# Altium schematic sheet MindPX2.2.SchDoc
size A2; Date: 2015/08/19; Author: SuDragon; Revision: MindPXV2.2
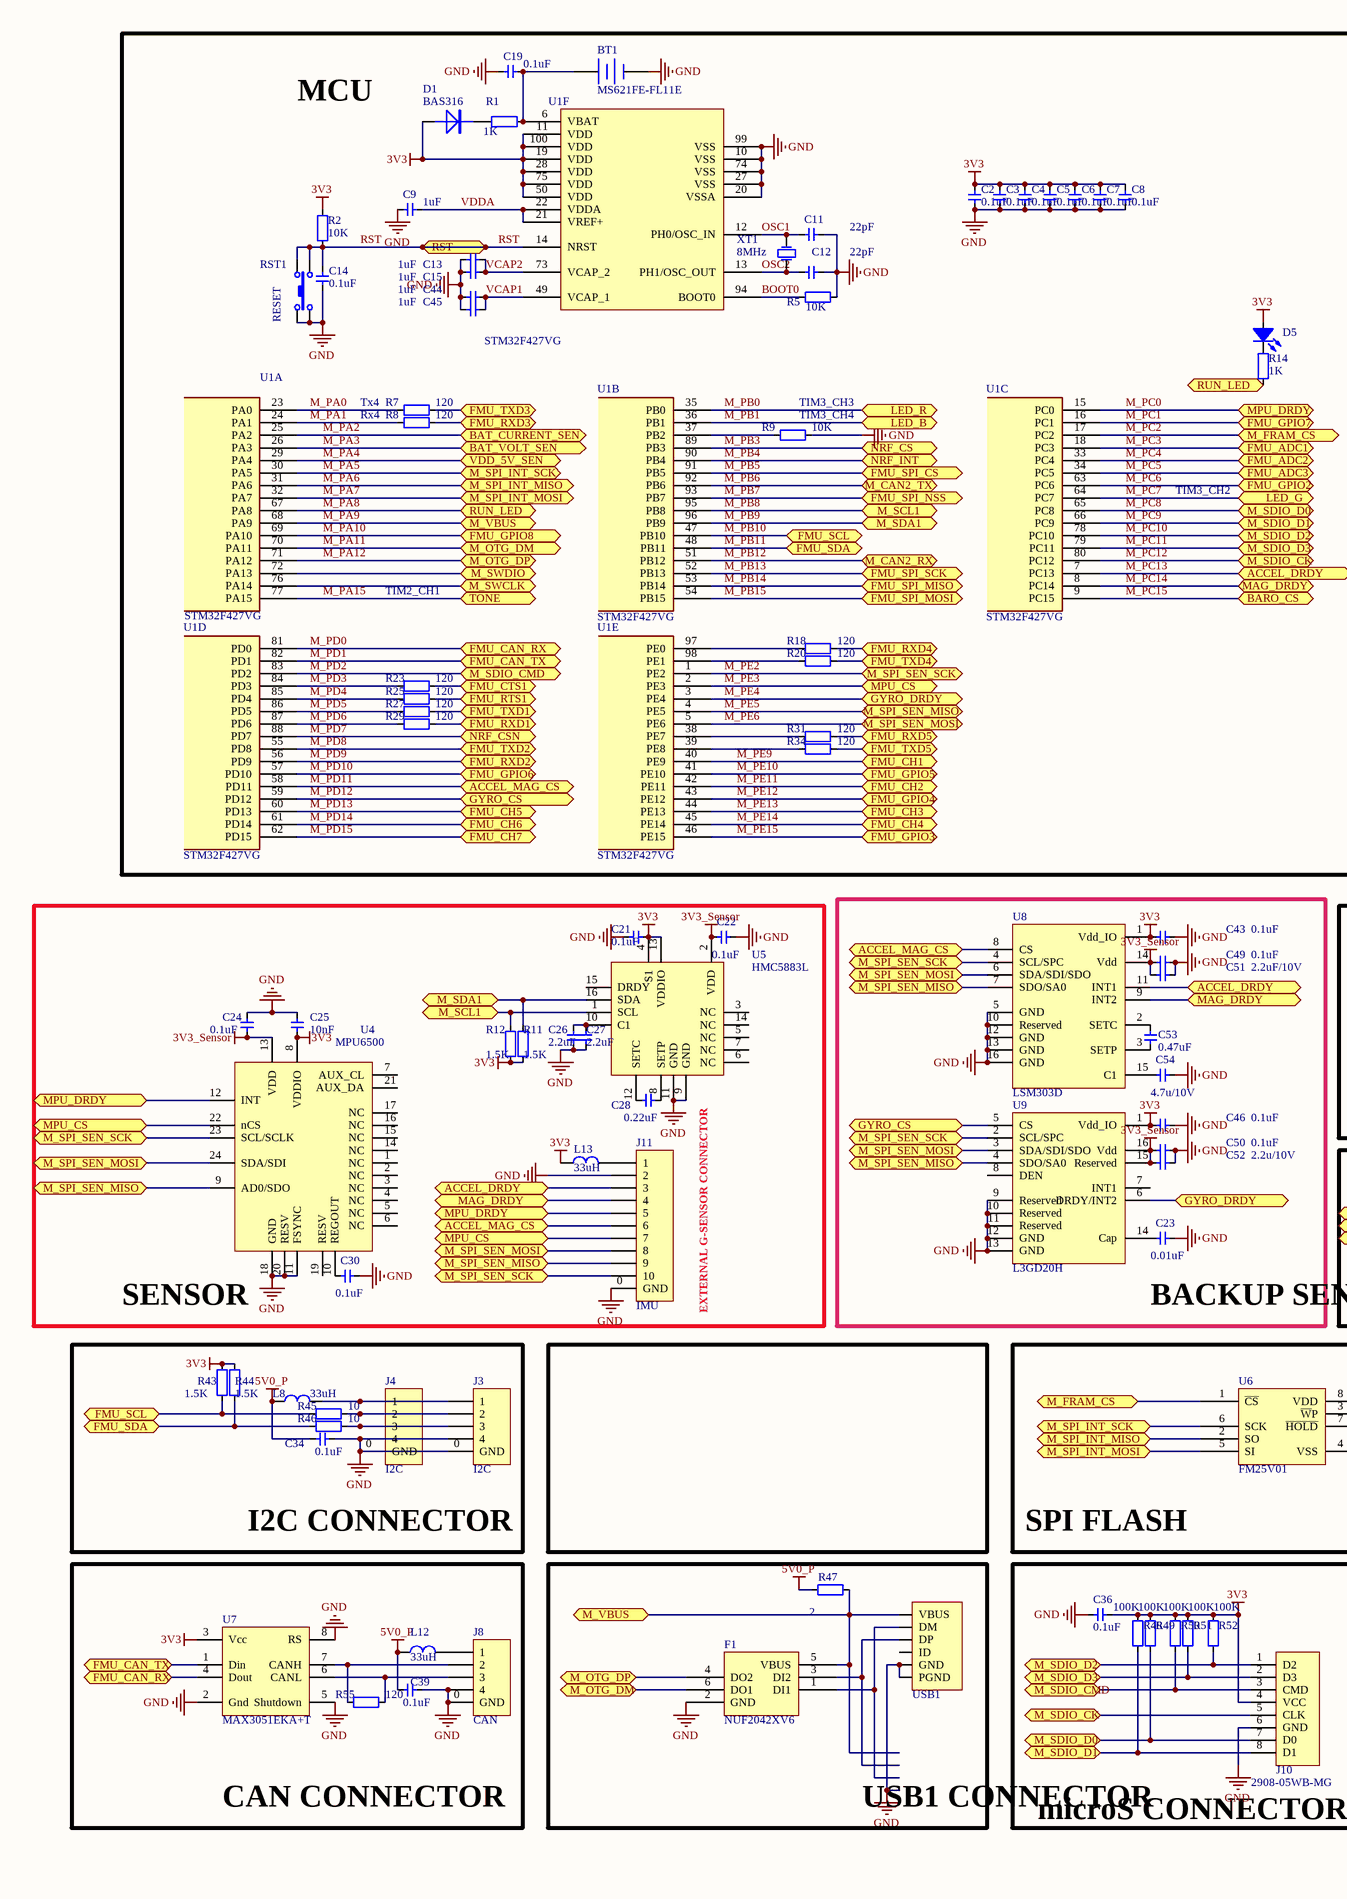
[diagram p0: MindPX2.2.SchDoc, left]
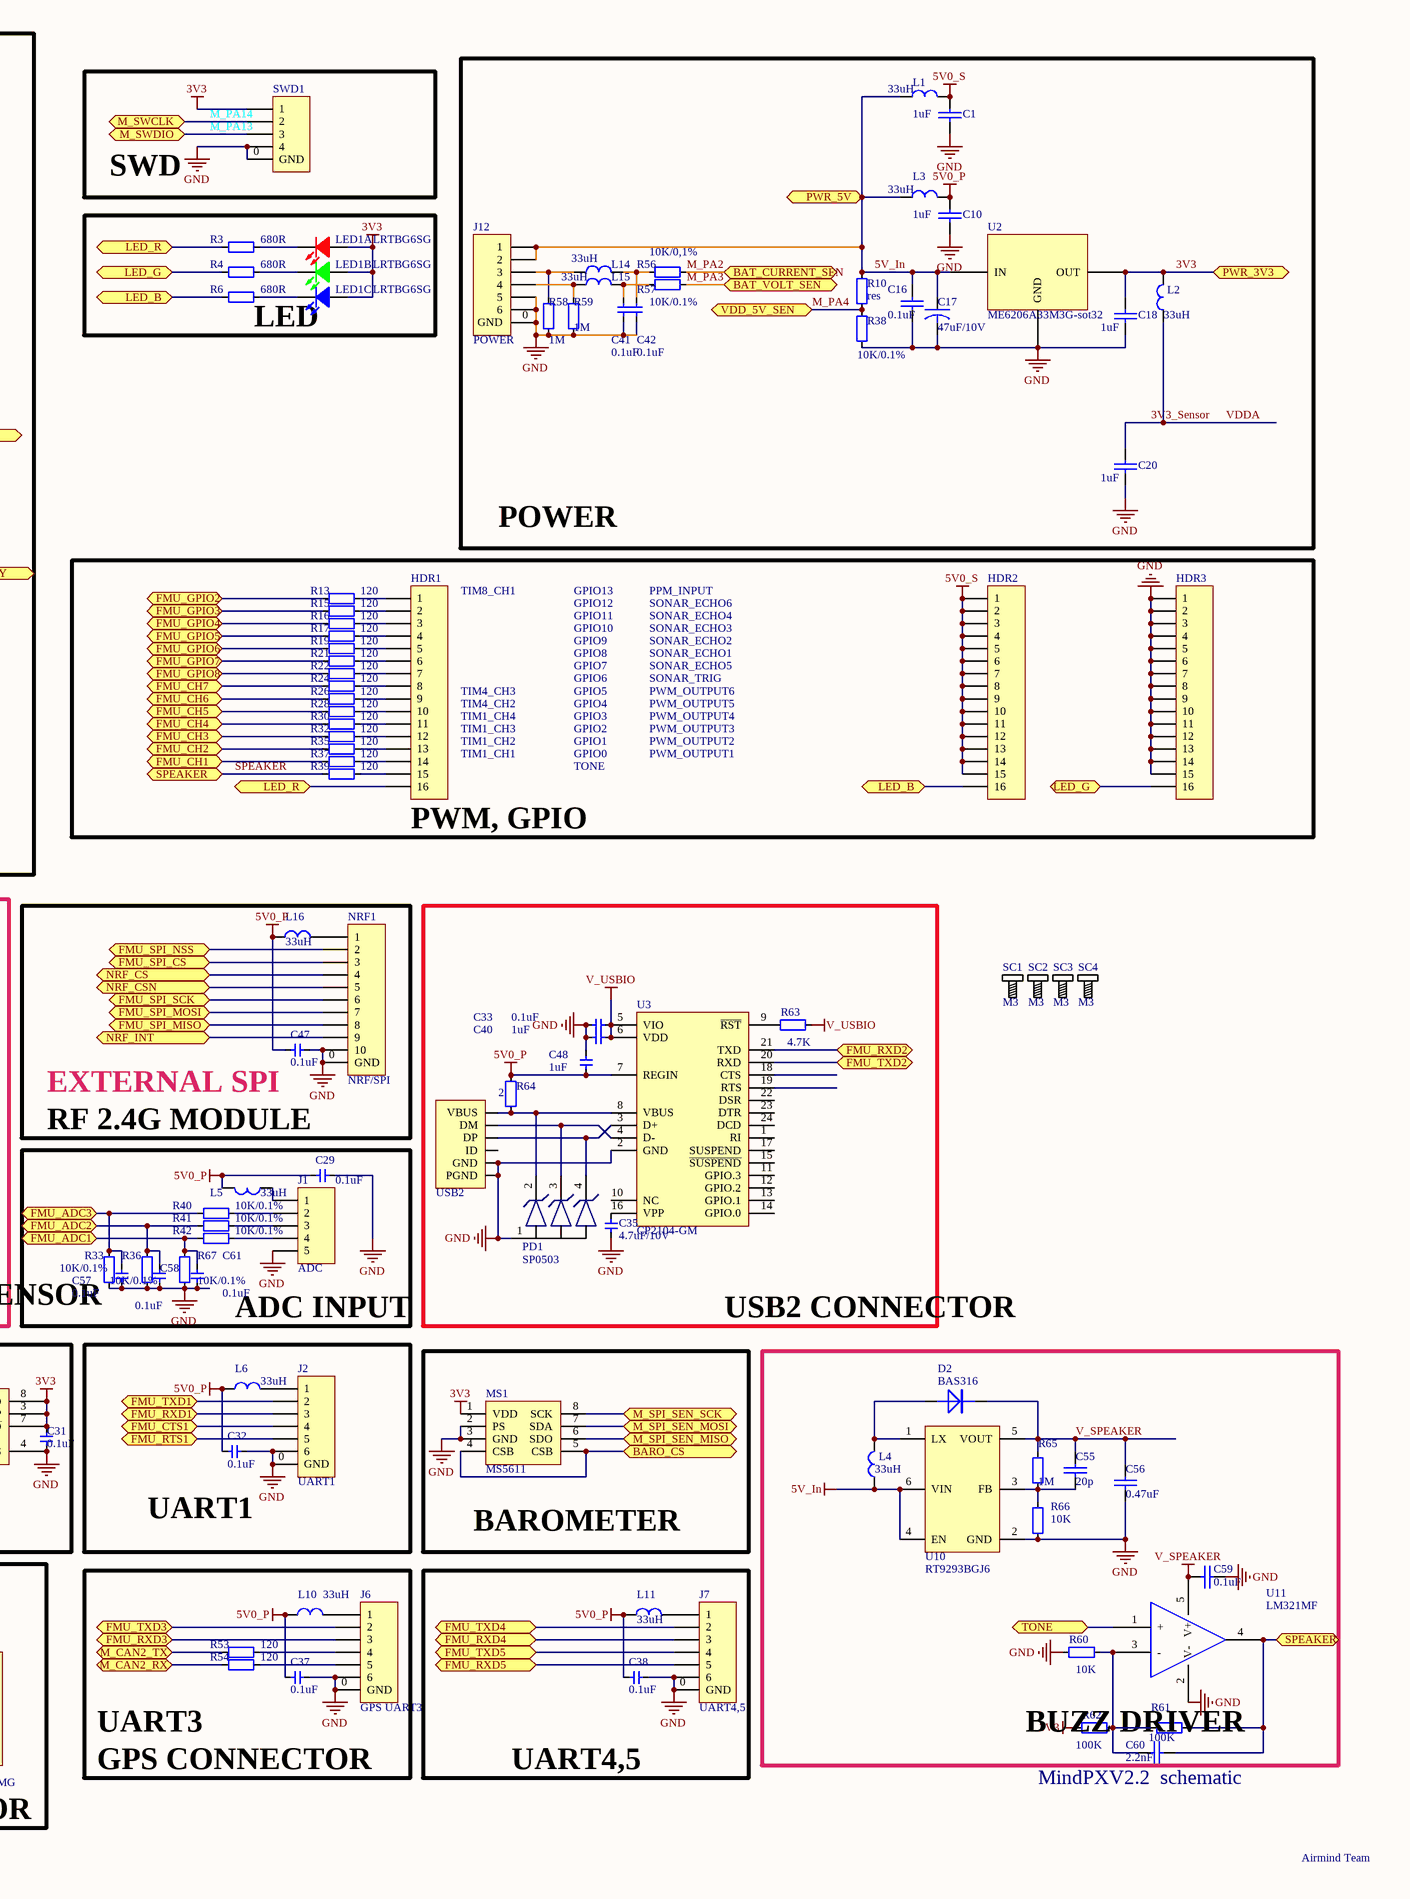
[diagram p1: MindPX2.2.SchDoc, right]

## Parts
BT1  MS621FE-FL11E  [MS621FE]
C1  value 1uF  [C0603]  (hidden comment: CAP)
C2  value 0.1uF  [C0603]  (hidden comment: cap)
C3  value 0.1uF  [C0603]  (hidden comment: cap)
C4  value 0.1uF  [C0603]  (hidden comment: cap)
C5  value 0.1uF  [C0603]  (hidden comment: cap)
C6  value 0.1uF  [C0603]  (hidden comment: cap)
C7  value 0.1uF  [C0603]  (hidden comment: cap)
C8  value 0.1uF  [C0603]  (hidden comment: cap)
C9  value 1uF  [C0603]  (hidden comment: cap)
C10  value 1uF  [C0603]  (hidden comment: CAP)
C11  value 22pF  [C0603]  (hidden comment: cap)
C12  value 22pF  [C0603]  (hidden comment: cap)
C13  value 1uF  [C0603]  (hidden comment: cap)
C14  value 0.1uF  [C0603]  (hidden comment: cap)
C15  value 1uF  [C0603]  (hidden comment: cap)
C16  value 0.1uF  [C0603]  (hidden comment: CAP)
C17  value 47uF/10V  [钽电容]  (hidden comment: cap)
C18  value 1uF  [C0603]  (hidden comment: CAP)
C19  value 0.1uF  [C0603]  (hidden comment: cap)
C20  1uF  [C0603]
C21  value 0.1uF  [C0603]  (hidden comment: cap)
C22  value 0.1uF  [C0603]  (hidden comment: cap)
C23  value 0.01uF  [C0603]  (hidden comment: cap)
C24  0.1uF  [C0603]
C25  10nF  [C0603]
C26  value 2.2uF  [C0603]  (hidden comment: cap)
C27  value 2.2uF  [C0603]  (hidden comment: cap)
C28  value 0.22uF  [C0603]  (hidden comment: cap)
C29  value 0.1uF  [C0603]  (hidden comment: cap)
C30  value 0.1uF  [C0603]  (hidden comment: cap)
C31  value 0.1uF  [C0603]  (hidden comment: cap)
C32  value 0.1uF  [C0603]  (hidden comment: cap)
C33  value 0.1uF  [C0603]  (hidden comment: cap)
C34  value 0.1uF  [C0603]  (hidden comment: cap)
C35  value 4.7uF/10V  [C0603]  (hidden comment: cap)
C36  value 0.1uF  [C0603]  (hidden comment: cap)
C37  value 0.1uF  [C0603]  (hidden comment: cap)
C38  value 0.1uF  [C0603]  (hidden comment: cap)
C39  value 0.1uF  [C0603]  (hidden comment: cap)
C40  value 1uF  [C0603]  (hidden comment: cap)
C41  value 0.1uF  [C0603]  (hidden comment: cap)
C42  value 0.1uF  [C0603]  (hidden comment: cap)
C43  value 0.1uF  [C0603]  (hidden comment: cap)
C44  value 1uF  [C0603]  (hidden comment: cap)
C45  value 1uF  [C0603]  (hidden comment: cap)
C46  value 0.1uF  [C0603]  (hidden comment: cap)
C47  0.1uF  [C0603]
C48  value 1uF  [C0603]  (hidden comment: cap)
C49  value 0.1uF  [C0603]  (hidden comment: cap)
C50  value 0.1uF  [C0603]  (hidden comment: cap)
C51  value 2.2uF/10V  [C0603]  (hidden comment: cap)
C52  value 2.2u/10V  [C0603]  (hidden comment: cap)
C53  value 0.47uF  [C0603]  (hidden comment: cap)
C54  value 4.7u/10V  [C0603]  (hidden comment: cap)
C55  value 20p  [C0603]  (hidden comment: CAP)
C56  value 0.47uF  [C0805]  (hidden comment: CAP)
C57  value 0.1uF  [C0603]  (hidden comment: cap)
C58  value 0.1uF  [C0603]  (hidden comment: cap)
C59  value 0.1uF  [C0603]  (hidden comment: CAP)
C60  value 2.2nF  [C0603]  (hidden comment: CAP)
C61  value 0.1uF  [C0603]  (hidden comment: cap)
D1  BAS316  [SOD323_AK]
D2  BAS316  [SOD323_AK]
D5  LED_0603  [0603]  (value not drawn)
F1  NUF2042XV6  [SOT-563-6]
HDR1  MHDR1X16  [HDR1X16]  (value not drawn)
HDR2  MHDR1X16  [HDR1X16]  (value not drawn)
HDR3  MHDR1X16  [HDR1X16]  (value not drawn)
J1  ADC  [HDR1X5]
J2  UART1  [DF13A-6P-1.25H]
J3  I2C  [DF13A-4P-1.25H]
J4  I2C  [DF13A-4P-1.25H]
J6  GPS UART3  [DF13A-6P-1.25H]
J7  UART4,5  [DF13A-6P-1.25H]
J8  CAN  [DF13A-4P-1.25H]
J10  2908-05WB-MG  [SD_Card_TF]
J11  IMU  [FPC10/0.5]
J12  POWER  [DF13A-6P-1.25H]
L1  value 33uH  [L0603]  (hidden comment: ind)
L2  33uH  [L0603]
L3  value 33uH  [L0603]  (hidden comment: ind)
L4  value 33uH  [L0805]  (hidden comment: Ind)
L5  value 33uH  [L0603]  (hidden comment: inductor)
L6  value 33uH  [L0603]  (hidden comment: ind)
L8  value 33uH  [L0603]  (hidden comment: ind)
L10  33uH  [L0603]
L11  value 33uH  [L0603]  (hidden comment: ind)
L12  value 33uH  [L0603]  (hidden comment: ind)
L13  value 33uH  [L0603]  (hidden comment: induator)
L14  value 33uH  [L0603]  (hidden comment: ind)
L15  value 33uH  [L0603]  (hidden comment: ind)
L16  value 33uH  [L0603]  (hidden comment: inductor)
LED1  LRTBG6SG  [LRTBG6SG]  (parts A,B,C of 3)
MS1  MS5611  [MS5611]
NRF1  NRF/SPI  [DF13A-10P-1.25H]
PD1  SP0503
R1  value 1K  [R0603]  (hidden comment: res)
R2  value 10K  [R0603]  (hidden comment: cap)
R3  value 680R  [R0603]  (hidden comment: res)
R4  value 680R  [R0603]  (hidden comment: res)
R5  value 10K  [R0603]  (hidden comment: res)
R6  value 680R  [R0603]  (hidden comment: res)
R7  value 120  [R0603]  (hidden comment: res)
R8  value 120  [R0603]  (hidden comment: res)
R9  value 10K  [R0603]  (hidden comment: res)
R10  res  [R0603]
R11  value 1.5K  [R0603]  (hidden comment: res)
R12  value 1.5K  [R0603]  (hidden comment: res)
R13  value 120  [R0603]  (hidden comment: res)
R14  value 1K  [R0603]  (hidden comment: res)
R15  value 120  [R0603]  (hidden comment: res)
R16  value 120  [R0603]  (hidden comment: res)
R17  value 120  [R0603]  (hidden comment: res)
R18  value 120  [R0603]  (hidden comment: res)
R19  value 120  [R0603]  (hidden comment: res)
R20  value 120  [R0603]  (hidden comment: res)
R21  value 120  [R0603]  (hidden comment: res)
R22  value 120  [R0603]  (hidden comment: res)
R23  value 120  [R0603]  (hidden comment: res)
R24  value 120  [R0603]  (hidden comment: res)
R25  value 120  [R0603]  (hidden comment: res)
R26  value 120  [R0603]  (hidden comment: res)
R27  value 120  [R0603]  (hidden comment: res)
R28  value 120  [R0603]  (hidden comment: res)
R29  value 120  [R0603]  (hidden comment: res)
R30  value 120  [R0603]  (hidden comment: res)
R31  value 120  [R0603]  (hidden comment: res)
R32  value 120  [R0603]  (hidden comment: res)
R33  value 10K/0.1%  [R0603]  (hidden comment: res)
R34  value 120  [R0603]  (hidden comment: res)
R35  value 120  [R0603]  (hidden comment: res)
R36  value 10K/0.1%  [R0603]  (hidden comment: res)
R37  value 120  [R0603]  (hidden comment: res)
R38  value 10K/0.1%  [R0603]  (hidden comment: res)
R39  value 120  [R0603]  (hidden comment: res)
R40  value 10K/0.1%  [R0603]  (hidden comment: res)
R41  value 10K/0.1%  [R0603]  (hidden comment: res)
R42  value 10K/0.1%  [R0603]  (hidden comment: res)
R43  value 1.5K  [R0603]  (hidden comment: res)
R44  value 1.5K  [R0603]  (hidden comment: res)
R45  value 10  [R0603]  (hidden comment: res)
R46  value 10  [R0603]  (hidden comment: res)
R47  value 2  [R0603]  (hidden comment: res)
R48  value 100K  [R0603]  (hidden comment: res)
R49  value 100K  [R0603]  (hidden comment: res)
R50  value 100K  [R0603]  (hidden comment: res)
R51  value 100K  [R0603]  (hidden comment: res)
R52  value 100K  [R0603]  (hidden comment: res)
R53  value 120  [R0603]  (hidden comment: res)
R54  value 120  [R0603]  (hidden comment: res)
R55  value 120  [R0603]  (hidden comment: res)
R56  value 10K/0,1%  [R0603]  (hidden comment: res)
R57  value 10K/0.1%  [R0603]  (hidden comment: res)
R58  value 1M  [R0603]  (hidden comment: res)
R59  value 1M  [R0603]  (hidden comment: res)
R60  value 10K  [R0603]  (hidden comment: res)
R61  value 100K  [R0603]  (hidden comment: res)
R62  value 100K  [R0603]  (hidden comment: res)
R63  value 4.7K  [R0603]  (hidden comment: res)
R64  value 2  [R0603]  (hidden comment: res)
R65  value 1M  [R0603]  (hidden comment: res)
R66  value 10K  [R0603]  (hidden comment: res)
R67  value 10K/0.1%  [R0603]  (hidden comment: res)
RST1  RESET  [BT_TACT_3.5*3.55_90]
SC1  M3  [SCRREW_M3]
SC2  M3  [SCRREW_M3]
SC3  M3  [SCRREW_M3]
SC4  M3  [SCRREW_M3]
SWD1  DEBUG  [DF13A-4P-1.25H]  (value not drawn)
U1  STM32F427VG  (parts A,B,C,D,E,F of 6)
U2  ME6206A33M3G-sot32  [me6206a33mg-sot23]
U3  CP2104-GM  [QFN24]
U4  MPU6500  [MPU6500]
U5  HMC5883L  [LPcc16]
U6  FM25V01  [so8]
U7  MAX3051EKA+T  [SOT23-8]
U8  LSM303D  [LSM303D]
U9  L3GD20H  [L3GD20H]
U10  RT9293BGJ6  [TSOT23-6]
U11  LM321MF  [SOT23-5]
USB1  USB_QG  [MicroUSB_T2]  (value not drawn)
USB2  USB_Micro  [MicroUSB_T2]  (value not drawn)
XT1  value 8MHz  [XTAL_5032]  (hidden comment: XTAL_5032_2P)

## Blocks framed on the sheet
MCU: BT1 C2-C9 C11-C15 C19 C44 C45 D1 D5 R1 R2 R5 R7-R9 R14 R18 R20 R23 R25 R27 R29 R31 R34 RST1 U1 XT1
POWER: C1 C10 C16-C18 C20 C41 C42 J12 L1-L3 L14 L15 R10 R38 R56-R59 U2
SWD: SWD1
LED: LED1 R3 R4 R6
PWM, GPIO: HDR1-HDR3 R13 R15-R17 R19 R21 R22 R24 R26 R28 R30 R32 R35 R37 R39
SENSOR: C21 C22 C24-C28 C30 J11 L13 R11 R12 U4 U5
BACKUP SENSOR: C23 C43 C46 C49-C54 U8 U9
USB2 CONNECTOR: C33 C35 C40 C48 PD1 R63 R64 U3 USB2
I2C CONNECTOR: C34 J3 J4 L8 R43-R46
SPI FLASH: C31 U6
UART1: C32 J2 L6
BAROMETER: MS1
BUZZ DRIVER: C55 C56 C59 C60 D2 L4 R60-R62 R65 R66 U10 U11
CAN CONNECTOR: C39 J8 L12 R55 U7
USB1 CONNECTOR: F1 R47 USB1
UART4,5: C38 J7 L11

## Ports
ACCEL_DRDY, ACCEL_MAG_CS, BARO_CS, BAT_CURRENT_SEN, BAT_VOLT_SEN, FMU_ADC1, FMU_ADC2, FMU_ADC3, FMU_CAN_RX, FMU_CAN_TX, FMU_CH1, FMU_CH2, FMU_CH3, FMU_CH4, FMU_CH5, FMU_CH6, FMU_CH7, FMU_CTS1, FMU_GPIO2, FMU_GPIO3, FMU_GPIO4, FMU_GPIO5, FMU_GPIO6, FMU_GPIO7, FMU_GPIO8, FMU_RTS1, FMU_RXD1, FMU_RXD2, FMU_RXD3, FMU_RXD4, FMU_RXD5, FMU_SCL, FMU_SDA, FMU_SPI_CS, FMU_SPI_MISO, FMU_SPI_MOSI, FMU_SPI_NSS, FMU_SPI_SCK, FMU_TXD1, FMU_TXD2, FMU_TXD3, FMU_TXD4, FMU_TXD5, GYRO_CS, GYRO_DRDY, LED_B, LED_G, LED_R, M_CAN2_RX, M_CAN2_TX, M_FRAM_CS, M_OTG_DM, M_OTG_DP, M_SCL1, M_SDA1, M_SDIO_CK, M_SDIO_CMD, M_SDIO_D0, M_SDIO_D1, M_SDIO_D2, M_SDIO_D3, M_SPI_INT_MISO, M_SPI_INT_MOSI, M_SPI_INT_SCK, M_SPI_SEN_MISO, M_SPI_SEN_MOSI, M_SPI_SEN_SCK, M_SWCLK, M_SWDIO, M_VBUS, MAG_DRDY, MPU_CS, MPU_DRDY, NRF_CS, NRF_CSN, NRF_INT, PWR_3V3, PWR_5V, RST, RUN_LED, SPEAKER, TONE, VDD_5V_SEN

## Nets
3V3: C2.1 C3.1 C4.1 C5.1 C6.1 C7.1 C8.1 C18.1 C21.2 C25.1 C31.1 C36.1 C43.2 C46.2 D1.A D5.2(A) J10.4(VCC) L2.2 L13.1 LED1.A1 LED1.A2 LED1.A3 MS1.1(VDD) R2.2 R11.2 R12.1 R43.1 R44.1 R48.1 R49.1 R50.1 R51.1 R52.1 R62.2 SWD1.1 U1.11(VDD) U1.19(VDD) U1.28(VDD) U1.50(VDD) U1.75(VDD) U1.100(VDD) U2.2(OUT) U4.8(VDDIO) U5.4(S1) U5.13(VDDIO) U6.3(~{W}P) U6.7(~{HOLD}) U6.8(VDD) U7.3(Vcc) U8.1(Vdd_IO) U9.1(Vdd_IO) ; port PWR_3V3
3V3_Sensor: C9.1 C20.1 C22.1 C24.2 C49.2 C50.2 C51.2 C52.2 L2.1 U1.21(VREF+) U1.22(VDDA) U4.13(VDD) U5.2(VDD) U8.14(Vdd) U9.15(Reserved) U9.16(Vdd)  [also labelled VDDA]
5V0_P: C10.1 C29.1 C32.1 C34.1 C37.1 C38.1 C39.1 C47.1 C48.2 L3.2 L5.2 L6.1 L8.1 L10.1 L11.1 L12.1 L16.1 R47.1 R64.1 U3.7(REGIN)
5V0_S: C1.1 HDR2.1 HDR2.2 HDR2.3 HDR2.4 HDR2.5 HDR2.6 HDR2.7 HDR2.8 HDR2.9 HDR2.10 HDR2.11 HDR2.12 HDR2.13 HDR2.14 HDR2.15 L1.2
5V_In: C16.1 C17.1 J12.1 J12.2 L1.1 L3.1 L4.1 R10.1 U2.3(IN) U10.4(EN) U10.6(VIN) ; port PWR_5V
GND: BT1.2(-) C1.2 C2.2 C3.2 C4.2 C5.2 C6.2 C7.2 C8.2 C9.2 C10.2 C11.1 C12.1 C13.1 C14.2 C15.2 C16.2 C17.2 C18.2 C19.2 C20.2 C21.1 C22.2 C23.1 C24.1 C25.2 C26.1 C27.1 C29.2 C30.1 C31.2 C32.2 C33.1 C34.2 C35.1 C36.2 C37.2 C38.2 C39.2 C40.1 C41.2 C42.2 C43.1 C44.2 C45.2 C46.1 C47.2 C48.1 C49.1 C50.1 C51.1 C52.1 C54.1 C56.2 C57.1 C58.1 C59.2 C61.1 F1.2(GND) HDR3.1 HDR3.2 HDR3.3 HDR3.4 HDR3.5 HDR3.6 HDR3.7 HDR3.8 HDR3.9 HDR3.10 HDR3.11 HDR3.12 HDR3.13 HDR3.14 HDR3.15 J1.5 J2.0(GND) J2.6 J3.0(GND) J3.4 J4.0(GND) J4.4 J6.0(GND) J6.6 J7.0(GND) J7.6 J8.0(GND) J8.4 J10.6(GND) J11.0(GND) J11.2 J12.0(GND) J12.5 J12.6 MS1.2(PS) MS1.3(GND) NRF1.0(GND) NRF1.10 PD1.1 R5.1 R9.1 R33.2 R36.2 R38.2 R58.2 R59.2 R60.1 R66.2 R67.2 RST1.1 RST1.3 SC1.0(GND) SC2.0(GND) SC3.0(GND) SC4.0(GND) SWD1.0(GND) SWD1.4 U1.10(VSS) U1.20(VSSA) U1.27(VSS) U1.74(VSS) U1.99(VSS) U2.1(GND) U3.2(GND) U4.11(FSYNC) U4.18(GND) U4.20(RESV) U5.9(GND) U5.11(GND) U6.4(VSS) U7.2(Gnd) U7.5(Shutdown) U7.8(RS) U8.5(GND) U8.10(Reserved) U8.12(GND) U8.13(GND) U8.16(GND) U9.9(Reserved) U9.10(Reserved) U9.11(Reserved) U9.12(GND) U9.13(GND) U10.2(GND) U11.2(V-) USB1.0(PGND) USB1.5(GND) USB2.0(PGND) USB2.5(GND)
V_SPEAKER: C55.1 C56.1 C59.1 D2.K R65.1 U10.5(VOUT) U11.5(V+)
V_USBIO: C33.2 C40.2 R63.2 U3.5(VIO) U3.6(VDD)
BOOT0: R5.2 U1.94(BOOT0)
FMU_CTS1: J2.4 R23.1 ; port FMU_CTS1
FMU_RTS1: J2.5 R25.1 ; port FMU_RTS1
FMU_RXD1: J2.3 R29.1 ; port FMU_RXD1
FMU_RXD3: J6.3 R8.1 ; port FMU_RXD3
FMU_RXD4: J7.3 R18.1 ; port FMU_RXD4
FMU_RXD5: J7.5 R31.1 ; port FMU_RXD5
FMU_TXD1: J2.2 R27.1 ; port FMU_TXD1
FMU_TXD3: J6.2 R7.1 ; port FMU_TXD3
FMU_TXD4: J7.2 R20.1 ; port FMU_TXD4
FMU_TXD5: J7.4 R34.1 ; port FMU_TXD5
M_PA0: R7.2 U1.23(PA0)
M_PA1: R8.2 U1.24(PA1)
M_PA2: R56.1 U1.25(PA2) ; port BAT_CURRENT_SEN
M_PA3: R57.1 U1.26(PA3) ; port BAT_VOLT_SEN
M_PA4: R10.2 R38.1 U1.29(PA4) ; port VDD_5V_SEN
M_PA5: U1.30(PA5) U6.6(SCK) ; port M_SPI_INT_SCK
M_PA6: U1.31(PA6) U6.2(SO) ; port M_SPI_INT_MISO
M_PA7: U1.32(PA7) U6.5(SI) ; port M_SPI_INT_MOSI
M_PA8: R14.1 U1.67(PA8) ; port RUN_LED
M_PA9: F1.5(VBUS) R47.2 U1.68(PA9) USB1.1(VBUS) ; port M_VBUS
M_PA10: R22.2 U1.69(PA10) ; port FMU_GPIO8
M_PA11: F1.6(DO1) U1.70(PA11) ; port M_OTG_DM
M_PA12: F1.4(DO2) U1.71(PA12) ; port M_OTG_DP
M_PA13: SWD1.3 U1.72(PA13) ; port M_SWDIO
M_PA14: SWD1.2 U1.76(PA14) ; port M_SWCLK
M_PA15: U1.77(PA15) U11.1(+) ; port TONE
M_PB0: HDR1.16 R3.2 U1.35(PB0) ; port LED_R
M_PB1: HDR2.16 R6.2 U1.36(PB1) ; port LED_B
M_PB3: NRF1.4 U1.89(PB3) ; port NRF_CS
M_PB4: NRF1.9 U1.90(PB4) ; port NRF_INT
M_PB5: NRF1.3 U1.91(PB5) ; port FMU_SPI_CS
M_PB6: R53.2 U1.92(PB6) ; port M_CAN2_TX
M_PB7: NRF1.2 U1.93(PB7) ; port FMU_SPI_NSS
M_PB8: R12.2 U1.95(PB8) U5.1(SCL) ; port M_SCL1
M_PB9: R11.1 U1.96(PB9) U5.16(SDA) ; port M_SDA1
M_PB10: R43.2 R45.2 U1.47(PB10) ; port FMU_SCL
M_PB11: R44.2 R46.2 U1.48(PB11) ; port FMU_SDA
M_PB12: R54.2 U1.51(PB12) ; port M_CAN2_RX
M_PB13: NRF1.6 U1.52(PB13) ; port FMU_SPI_SCK
M_PB14: NRF1.8 U1.53(PB14) ; port FMU_SPI_MISO
M_PB15: NRF1.7 U1.54(PB15) ; port FMU_SPI_MOSI
M_PC0: J11.5 U1.15(PC0) U4.12(INT) ; port MPU_DRDY
M_PC1: R21.2 U1.16(PC1) ; port FMU_GPIO7
M_PC2: U1.17(PC2) U6.1(~{CS}) ; port M_FRAM_CS
M_PC3: C61.2 R42.2 R67.1 U1.18(PC3) ; port FMU_ADC1
M_PC4: C58.2 R36.1 R41.2 U1.33(PC4) ; port FMU_ADC2
M_PC5: C57.2 R33.1 R40.2 U1.34(PC5) ; port FMU_ADC3
M_PC6: R13.2 U1.63(PC6) ; port FMU_GPIO2
M_PC7: HDR3.16 R4.2 U1.64(PC7) ; port LED_G
M_PC8: J10.7(D0) R49.2 U1.65(PC8) ; port M_SDIO_D0
M_PC9: J10.8(D1) R48.2 U1.66(PC9) ; port M_SDIO_D1
M_PC10: J10.1(D2) R52.2 U1.78(PC10) ; port M_SDIO_D2
M_PC11: J10.2(D3) R51.2 U1.79(PC11) ; port M_SDIO_D3
M_PC12: J10.5(CLK) U1.80(PC12) ; port M_SDIO_CK
M_PC13: J11.3 U1.7(PC13) U8.11(INT1) ; port ACCEL_DRDY
M_PC14: J11.4 U1.8(PC14) U8.9(INT2) ; port MAG_DRDY
M_PC15: MS1.4(CSB) MS1.5(CSB) U1.9(PC15) ; port BARO_CS
M_PD0: U1.81(PD0) U7.4(Dout) ; port FMU_CAN_RX
M_PD1: U1.82(PD1) U7.1(Din) ; port FMU_CAN_TX
M_PD2: J10.3(CMD) R50.2 U1.83(PD2) ; port M_SDIO_CMD
M_PD3: R23.2 U1.84(PD3)
M_PD4: R25.2 U1.85(PD4)
M_PD5: R27.2 U1.86(PD5)
M_PD6: R29.2 U1.87(PD6)
M_PD7: NRF1.5 U1.88(PD7) ; port NRF_CSN
M_PD8: U1.55(PD8) U3.20(RXD) ; port FMU_TXD2
M_PD9: U1.56(PD9) U3.21(TXD) ; port FMU_RXD2
M_PD10: R19.2 U1.57(PD10) ; port FMU_GPIO6
M_PD11: J11.6 U1.58(PD11) U8.8(CS) ; port ACCEL_MAG_CS
M_PD12: U1.59(PD12) U9.5(CS) ; port GYRO_CS
M_PD13: R28.2 U1.60(PD13) ; port FMU_CH5
M_PD14: R26.2 U1.61(PD14) ; port FMU_CH6
M_PD15: R24.2 U1.62(PD15) ; port FMU_CH7
M_PE2: J11.10 MS1.8(SCK) U1.1(PE2) U4.23(SCL/SCLK) U8.4(SCL/SPC) U9.2(SCL/SPC) ; port M_SPI_SEN_SCK
M_PE3: J11.7 U1.2(PE3) U4.22(nCS) ; port MPU_CS
M_PE4: U1.3(PE4) U9.6(DRDY/INT2) ; port GYRO_DRDY
M_PE5: J11.9 MS1.6(SDO) U1.4(PE5) U4.9(AD0/SDO) U8.7(SDO/SA0) U9.4(SDO/SA0) ; port M_SPI_SEN_MISO
M_PE6: J11.8 MS1.7(SDA) U1.5(PE6) U4.24(SDA/SDI) U8.6(SDA/SDI/SDO) U9.3(SDA/SDI/SDO) ; port M_SPI_SEN_MOSI
M_PE9: R37.2 U1.40(PE9) ; port FMU_CH1
M_PE10: R17.2 U1.41(PE10) ; port FMU_GPIO5
M_PE11: R35.2 U1.42(PE11) ; port FMU_CH2
M_PE12: R16.2 U1.43(PE12) ; port FMU_GPIO4
M_PE13: R32.2 U1.44(PE13) ; port FMU_CH3
M_PE14: R30.2 U1.45(PE14) ; port FMU_CH4
M_PE15: R15.2 U1.46(PE15) ; port FMU_GPIO3
OSC1: C11.2 U1.12(PH0/OSC_IN) XT1.2(OSC2)
OSC2: C12.2 U1.13(PH1/OSC_OUT) XT1.1(OSC1)
RST: C14.1 R2.1 RST1.2 RST1.4 U1.14(NRST) ; port RST
SPEAKER: C60.2 R39.2 R61.2 U11.4 ; port SPEAKER
VCAP1: C44.1 C45.1 U1.49(VCAP_1)
VCAP2: C13.2 C15.1 U1.73(VCAP_2)
NetBT1_1: BT1.1(+) C19.1 R1.1 U1.6(VBAT)
NetC23_2: C23.2 U9.14(Cap)
NetC26_2: C26.2 C27.2 U5.10(C1)
NetC28_1: C28.1 U5.12(SETC)
NetC28_2: C28.2 U5.8(SETP)
NetC30_2: C30.2 U4.10(REGOUT)
NetC35_2: C35.2 U3.16(VPP)
NetC41_1: C41.1 L15.1 R57.2
NetC42_1: C42.1 L14.1 R56.2
NetC53_1: C53.1 U8.2(SETC)
NetC53_2: C53.2 U8.3(SETP)
NetC54_2: C54.2 U8.15(C1)
NetC55_2: C55.2 R65.2 R66.1 U10.3(FB)
NetC60_1: C60.1 R60.2 R61.1 R62.1 U11.3(-)
NetD1_K: D1.K R1.2
NetD2_A: D2.A L4.2 U10.1(LX)
NetD5_1: D5.1(K) R14.2
NetF1_1: F1.1(DI1) USB1.2(DM)
NetF1_3: F1.3(DI2) USB1.3(DP)
NetHDR1_1: HDR1.1 R13.1
NetHDR1_2: HDR1.2 R15.1
NetHDR1_3: HDR1.3 R16.1
NetHDR1_4: HDR1.4 R17.1
NetHDR1_5: HDR1.5 R19.1
NetHDR1_6: HDR1.6 R21.1
NetHDR1_7: HDR1.7 R22.1
NetHDR1_8: HDR1.8 R24.1
NetHDR1_9: HDR1.9 R26.1
NetHDR1_10: HDR1.10 R28.1
NetHDR1_11: HDR1.11 R30.1
NetHDR1_12: HDR1.12 R32.1
NetHDR1_13: HDR1.13 R35.1
NetHDR1_14: HDR1.14 R37.1
NetHDR1_15: HDR1.15 R39.1
NetJ1_1: J1.1 L5.1
NetJ1_2: J1.2 R40.1
NetJ1_3: J1.3 R41.1
NetJ1_4: J1.4 R42.1
NetJ2_1: J2.1 L6.2
NetJ3_1: J3.1 J4.1 L8.2
NetJ3_2: J3.2 J4.2 R45.1
NetJ3_3: J3.3 J4.3 R46.1
NetJ6_1: J6.1 L10.2
NetJ6_4: J6.4 R53.1
NetJ6_5: J6.5 R54.1
NetJ7_1: J7.1 L11.2
NetJ8_1: J8.1 L12.2
NetJ8_2: J8.2 R55.2 U7.7(CANH)
NetJ8_3: J8.3 R55.1 U7.6(CANL)
NetJ11_1: J11.1 L13.2
NetJ12_3: J12.3 L14.2 R58.1
NetJ12_4: J12.4 L15.2 R59.1
NetL16_2: L16.2 NRF1.1
NetLED1_C1: LED1.C1 R3.1
NetLED1_C2: LED1.C2 R4.1
NetLED1_C3: LED1.C3 R6.1
NetPD1_2: PD1.2 R64.2 U3.8(VBUS) USB2.1(VBUS)
NetPD1_3: PD1.3 U3.4(D-) USB2.2(DM)
NetPD1_4: PD1.4 U3.3(D+) USB2.3(DP)
NetR9_2: R9.2 U1.37(PB2)
NetR18_2: R18.2 U1.97(PE0)
NetR20_2: R20.2 U1.98(PE1)
NetR31_2: R31.2 U1.38(PE7)
NetR34_2: R34.2 U1.39(PE8)
NetR63_1: R63.1 U3.9(~{RST})

Not connected (* = marked no-connect by the designer): U3 1(RI) 10(NC) 11(GPIO.3) 12(GPIO.2) 13(GPIO.1) 14(GPIO.0) 15(~{SUSPEND}) 17(SUSPEND) 18(CTS) 19(RTS) 22(DSR) 23(DTR) 24(DCD); U4 1(NC) 2(NC) 3(NC) 4(NC) 5(NC) 6(NC) 7(AUX_CL) 14(NC) 15(NC) 16(NC) 17(NC) 19(RESV) 21(AUX_DA); U5 3(NC) 5(NC) 6(NC) 7(NC) 14(NC) 15(DRDY); U9 7(INT1) 8(DEN); USB1 4(ID); USB2 4(ID)

## Notes on the sheet
- Tx4
- Rx4
- (near R9) TIM3_CH3
- (near R9) TIM3_CH4
- TIM3_CH2
- TIM2_CH1
- TIM8_CH1
- GPIO12
- GPIO13
- SONAR_ECHO6
- PPM_INPUT
- GPIO7
- GPIO8
- GPIO9
- GPIO10
- GPIO11
- SONAR_ECHO1
- SONAR_ECHO2
- SONAR_ECHO3
- SONAR_ECHO4
- SONAR_ECHO5
- TIM1_CH3
- TIM1_CH4
- TIM4_CH3
- TIM4_CH2
- GPIO2
- GPIO3
- GPIO4
- GPIO5
- GPIO6
- SONAR_TRIG
- PWM_OUTPUT3
- PWM_OUTPUT4
- PWM_OUTPUT5
- PWM_OUTPUT6
- TIM1_CH1
- TIM1_CH2
- GPIO0
- GPIO1
- TONE
- PWM_OUTPUT1
- PWM_OUTPUT2
- EXTERNAL SPI
- RF 2.4G MODULE
- EXTERNAL G-SENSOR CONNECTOR
- ADC INPUT
- UART3
- GPS CONNECTOR
- (near C60) MindPXV2.2  schematic
- Airmind Team
- Labels drawn without touching a wire or pin: microS CONNECTOR
- (in symbol MPU-6500) Text

## Library data of the parts
BT1 = Battery: Multicell Battery; Published: 24-Mar-1999; LatestRevisionDate: 17-Jul-2002; LatestRevisionNote: Re-released for DXP Platform.; PackageReference: BAT-2; Publisher: Altium Limited
C1 C10 C16 C18 C20 C55 C56 C59 C60 = CAP: Capacitor
  C20: value: 1uF
C2-C9 C11-C15 C19 C21-C54 C57 C58 C61 = Cap_0603: Capacitor
  C24: value: 0.1uF
  C25: value: 10nF
  C47: Value: 0.1uF
C17 = CAPACITOR
D1 D2 = DIODE
D5 = LED_0603: LED
HDR1-HDR3 = MHDR1X16: Header, 16-Pin; LatestRevisionDate: 17-Jul-2002; LatestRevisionNote: Re-released for DXP Platform.; Publisher: Altium Limited
J1 = Header 5: Header, 5-Pin; LatestRevisionDate: 17-Jul-2002; LatestRevisionNote: Re-released for DXP Platform.; Publisher: Altium Limited
J2 J6 J7 J12 = DF13_6: Header, 7-Pin; LatestRevisionDate: 17-Jul-2002; LatestRevisionNote: Re-released for DXP Platform.; Publisher: Altium Limited
J3 J4 J8 SWD1 = DF13_4: Header,4-Pin; LatestRevisionDate: 17-Jul-2002; LatestRevisionNote: Re-released for DXP Platform.; Publisher: Altium Limited
J10 = microSD_interface: SD
J11 NRF1 = DF13_10: Header, 8-Pin; LatestRevisionDate: 17-Jul-2002; LatestRevisionNote: Re-released for DXP Platform.; Publisher: Altium Limited
L1-L4 L6 L8 L10-L15 = Inductor_smt: Inductor; Code_IEC: 1005; Published: 8-Jun-2000; LatestRevisionDate: 29-May-2009; PackageReference: 0402-A; Publisher: Altium Limited; PackageDescription: Chip Inductor; Code_JEITA: 0402
  L2: value: 33uH
  L4 L6 L8 L10-L13: LatestRevisionNote: IPC-7351 Footprint Added.
L5 L16 = Inductor_smt: Code_IEC: 1005; Published: 8-Jun-2000; LatestRevisionDate: 29-May-2009; LatestRevisionNote: IPC-7351 Footprint Added.; PackageReference: 0402-A; Publisher: Altium Limited; PackageDescription: Chip Inductor; Code_JEITA: 0402
MS1 = MS5611: Sensor
R1-R67 = Res_0603: Resistor
RST1 = BT_TACT_3.5*5_90: Switch
SC1-SC4 = Screw_M3: Screw
U1 = STM32F427VX
U2 = SOP-3
U3 = CP2104
U4 = MPU-6500
U7 = MAX3051
U10 = RT9293: 注意要50V的，不要搞成20V的
USB1 USB2 = USB_Micro: USB
XT1 = XTAL_5032_2P: Crystal Oscillator